# EAGLE design Netzteil_CA1 (EAGLE 8.6.3)

## Sheet 1 of 3
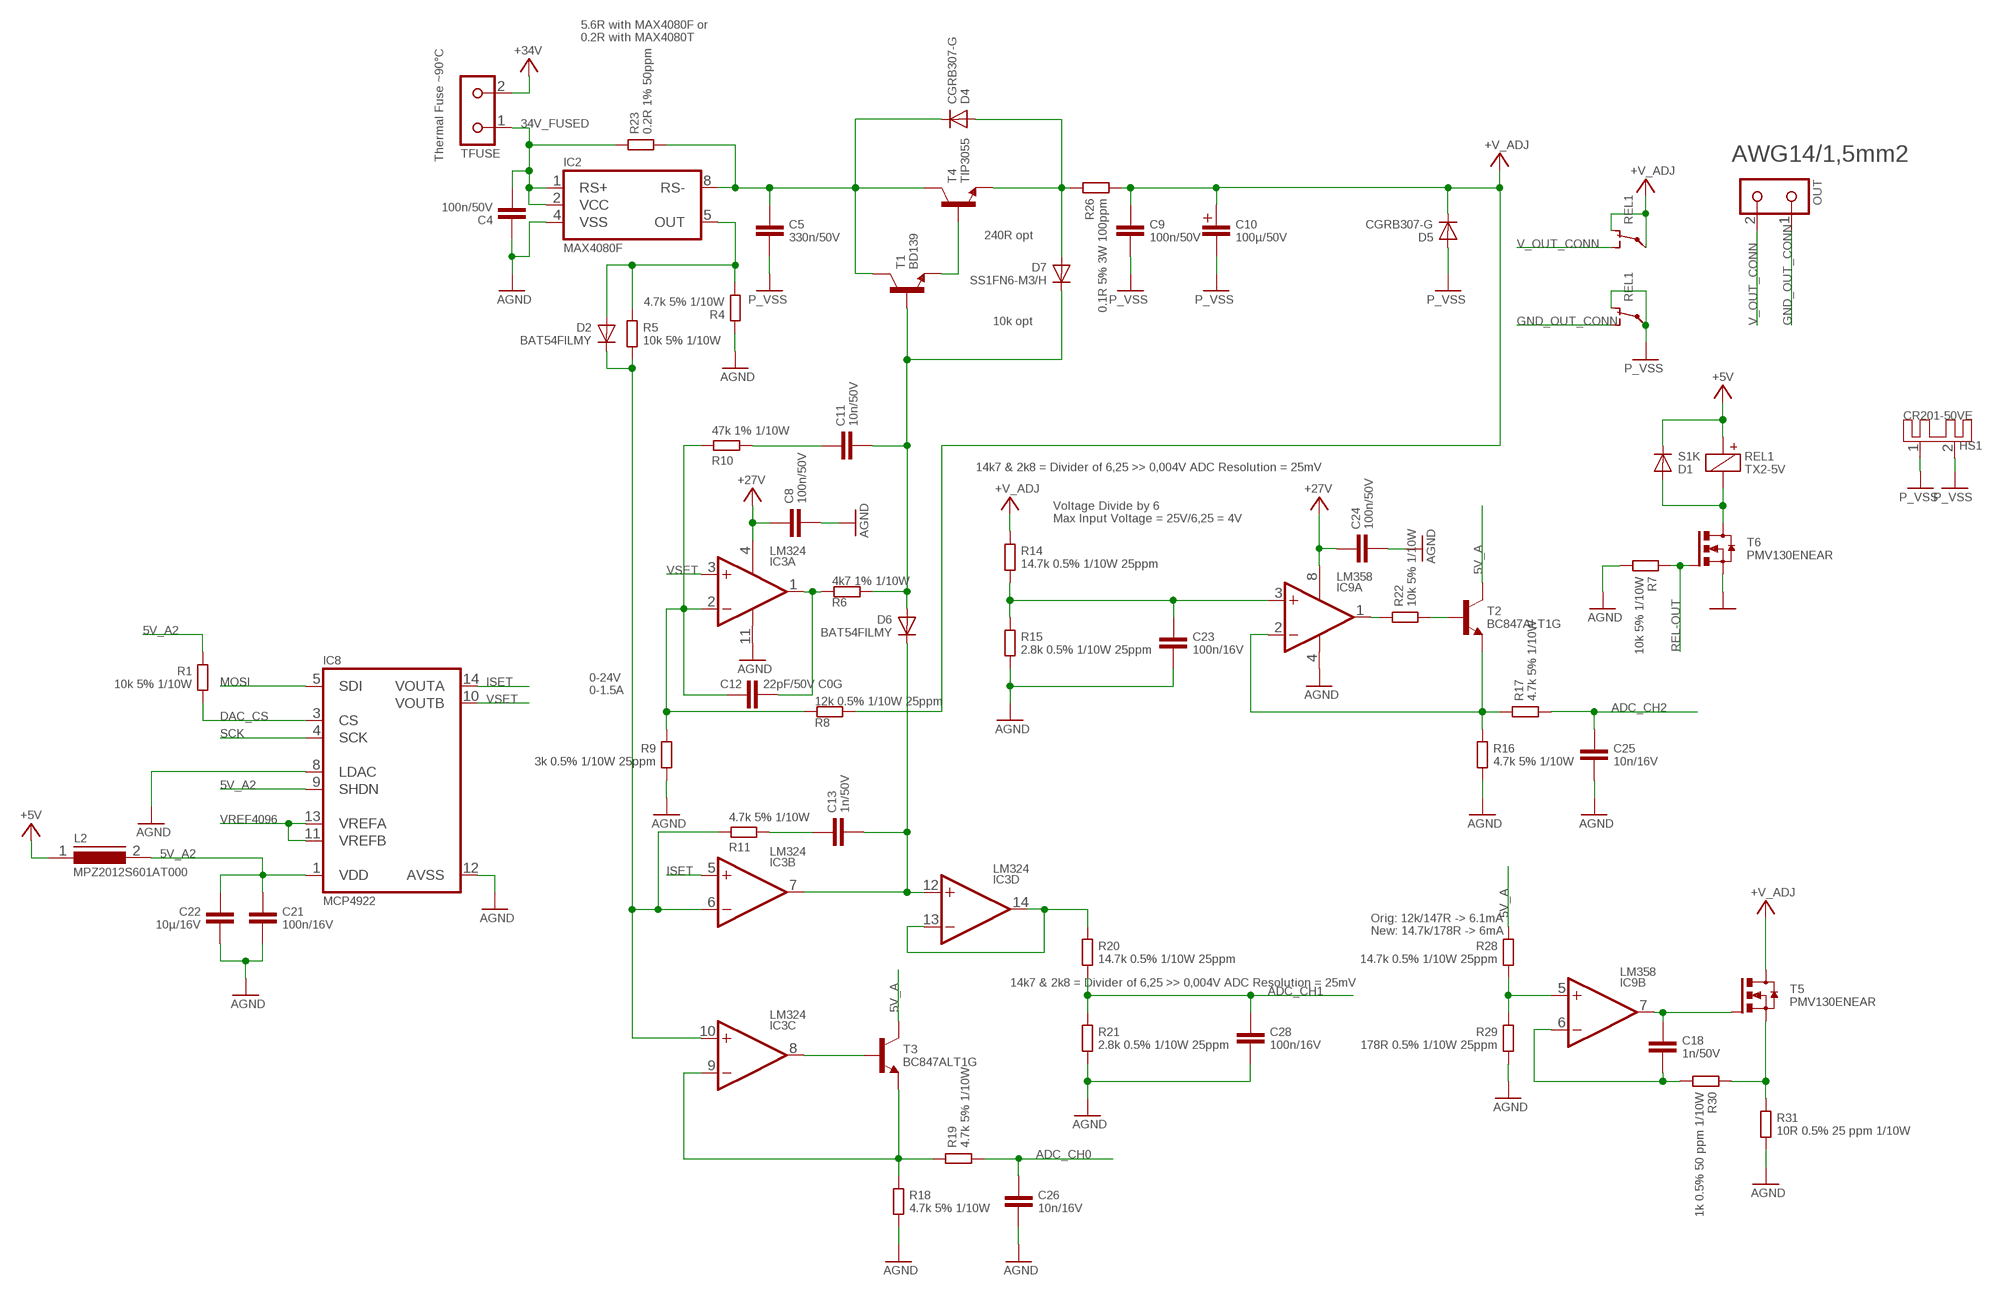
[diagram p0: schematic, sheet 1]

### Parts
C4  100n/50V  CC/0805  [0805]
C5  330n/50V  CC/0805  [0805]
C8  100n/50V  CC/0805  [0805]
C9  100n/50V  CC/0805  [0805]
C10  100µ/50V  C+3.5/8  [C+/3.5/8]
C11  10n/50V  CC/0805  [0805]
C12  22pF/50V C0G  CC/0805  [0805]
C13  1n/50V  CC/0805  [0805]
C18  1n/50V  CC/0805  [0805]
C21  100n/16V  CC/0805  [0805]
C22  10µ/16V  CC/1206  [1206]
C23  100n/16V  CC/0805  [0805]
C24  100n/50V  CC/0805  [0805]
C25  10n/16V  CC/0805  [0805]
C26  10n/16V  CC/0805  [0805]
C28  100n/16V  CC/0805  [0805]
D1  S1K  D  [DO214AC]
D2  BAT54FILMY  DBAT54FILMY  [SOT23]
D4  CGRB307-G  DWIDE  [DO214AA-CGRB307-G]
D5  CGRB307-G  DWIDE  [DO214AA-CGRB307-G]
D6  BAT54FILMY  DBAT54FILMY  [SOT23]
D7  SS1FN6-M3/H  DDO219AB-2  [DO219AB-2]
HS1  CR201-50VE  HSCR201-50  [CR201-50]
IC2  MAX4080F  MAX4080  [SOP8]
IC3  LM324  QUAD-OPVOPA4197  [SO14]
IC8  MCP4922  [TSSOP14]
IC9  LM358  DUAL-OPVSOP8  [SOP8]
L2  MPZ2012S601AT000  L0805  [C0805K]
OUT  KL2691311500002  [KL2-691311500002]
R1  10k 5% 1/10W  R-SMD0805  [C0805K]
R4  4.7k 5% 1/10W  R-SMD0805  [C0805K]
R5  10k 5% 1/10W  R-SMD0805  [C0805K]
R6  4k7 1% 1/10W  R-SMD0805  [C0805K]
R7  10k 5% 1/10W  R-SMD0805  [C0805K]
R8  12k 0.5% 1/10W 25ppm  R-SMD0805  [C0805K]
R9  3k 0.5% 1/10W 25ppm  R-SMD0805  [C0805K]
R10  47k 1% 1/10W  R-SMD0805  [C0805K]
R11  4.7k 5% 1/10W  R-SMD0805  [C0805K]
R14  14.7k 0.5% 1/10W 25ppm  R-SMD0805  [C0805K]
R15  2.8k 0.5% 1/10W 25ppm  R-SMD0805  [C0805K]
R16  4.7k 5% 1/10W  R-SMD0805  [C0805K]
R17  4.7k 5% 1/10W  R-SMD0805  [C0805K]
R18  4.7k 5% 1/10W  R-SMD0805  [C0805K]
R19  4.7k 5% 1/10W  R-SMD0805  [C0805K]
R20  14.7k 0.5% 1/10W 25ppm  R-SMD0805  [C0805K]
R21  2.8k 0.5% 1/10W 25ppm  R-SMD0805  [C0805K]
R22  10k 5% 1/10W  R-SMD0805  [C0805K]
R23  0.2R 1% 50ppm  R-SMDLRMAP2512  [LRMAP2512]
R26  0.1R 5% 3W 100ppm  R-SMD2512  [YAG_PT2512]
R28  14.7k 0.5% 1/10W 25ppm  R-SMD0805  [C0805K]
R29  178R 0.5% 1/10W 25ppm  R-SMD0805  [C0805K]
R30  1k 0.5% 50 ppm 1/10W  R-SMD0805  [C0805K]
R31  10R 0.5% 25 ppm 1/10W  R-SMD0805  [C0805K]
REL1  TX2-5V  REL-2UTX2  [REL-TX2]
T1  BD139  T-NPNTO126-ECB  [TO126]
T2  BC847ALT1G  T-NPNSOT23-BEC  [SOT23-BEC]
T3  BC847ALT1G  T-NPNSOT23-BEC  [SOT23-BEC]
T4  TIP3055  T-NPNTOP3AV-BCE  [TOP3AV]
T5  PMV130ENEAR  T-NMOSIRLML2502PBF  [SOT23]
T6  PMV130ENEAR  T-NMOSIRLML2502PBF  [SOT23]
TFUSE  KL2691311500002  [KL2-691311500002]

### Nets
5V_A: R28.1 T2.C T3.C ; also sheet 2,3
5V_A2: C21.1 C22.1 IC8.1(VDD) IC8.9(SHDN) L2.2 R1.1
34V_FUSED: C4.2 IC2.1(RS+) IC2.2(VCC) R23.1 TFUSE.1
+5V: D1.C L2.1 REL1.+(1:+) ; also sheet 2,3
+27V: C8.1 C24.1 IC3.4(PWR:V+) IC9.8(PWR:V+) ; also sheet 2
+34V: TFUSE.2 ; also sheet 2
+V_ADJ: C9.1 C10.+ D5.C R8.1 R14.1 R26.2 REL1.O1(2:O) REL1.P1(2:P) T5.3(D)
ADC_CH0: C26.1 R19.2 ; also sheet 3
ADC_CH1: C28.1 R20.2 R21.1 ; also sheet 3
ADC_CH2: C25.1 R17.2 ; also sheet 3
AGND: C4.1 C8.2 C21.2 C22.2 C23.2 C24.2 C25.2 C26.2 C28.2 IC2.4(VSS) IC3.11(PWR:V-) IC8.8(LDAC) IC8.12(AVSS) IC9.4(PWR:V-) R4.1 R7.2 R9.2 R15.2 R16.2 R18.2 R21.2 R29.2 R31.2 ; also sheet 2,3
DAC_CS: IC8.3(CS) R1.2 ; also sheet 3
GND_OUT_CONN: OUT.1 REL1.S2(3:S)
ISET: IC3.5(B:+IN) IC8.14(VOUTA)
MOSI: IC8.5(SDI) ; also sheet 3
N$1: C5.1 D4.C IC2.8(RS-) R23.2 T1.2(C) T4.C
N$5: D2.1(A) IC2.5(OUT) R4.2 R5.1
N$6: D2.3(C) IC3.6(B:-IN) IC3.10(C:+IN) R5.2 R11.2
N$7: C12.2 IC3.1(A:OUT) R6.2
N$8: C11.2 D6.1(A) D7.C R6.1 T1.3(B)
N$9: C11.1 R10.1
N$10: C13.2 D6.3(C) IC3.7(B:OUT) IC3.12(D:+IN)
N$11: IC3.13(D:-IN) IC3.14(D:OUT) R20.1
N$12: C13.1 R11.1
N$13: D1.A REL1.-(1:-) T6.3(D)
N$16: IC9.1(A:OUT) R22.1
N$17: C23.1 IC9.3(A:+IN) R14.2 R15.1
N$18: C12.1 IC3.2(A:-IN) R8.2 R9.1 R10.2
N$19: IC9.2(A:-IN) R16.1 R17.1 T2.E
N$20: IC3.9(C:-IN) R18.1 R19.1 T3.E
N$21: R22.2 T2.B
N$22: IC9.5(B:+IN) R28.2 R29.1
N$23: D4.A D7.A R26.1 T4.E
N$24: IC3.8(C:OUT) T3.B
N$25: C18.2 IC9.6(B:-IN) R30.2
N$26: C18.1 IC9.7(B:OUT) T5.1(G)
N$28: T1.1(E) T4.B
N$30: R30.1 R31.1 T5.2(S)
P_VSS: C5.2 C9.2 C10.- D5.A HS1.1 HS1.2 REL1.O2(3:O) REL1.P2(3:P) ; also sheet 2
REL-OUT: R7.1 T6.1(G) ; also sheet 3
SCK: IC8.4(SCK) ; also sheet 3
V_OUT_CONN: OUT.2 REL1.S1(2:S)
VREF4096: IC8.11(VREFB) IC8.13(VREFA) ; also sheet 2,3
VSET: IC3.3(A:+IN) IC8.10(VOUTB)
VSS: T6.2(S) ; also sheet 2,3

### Notes on the sheet
- 5.6R with MAX4080F or 
  0.2R with MAX4080T
- Thermal Fuse ~90°C | AWG14/1,5mm2
- 240R opt
- 10k opt
- 14k7 & 2k8 = Divider of 6,25 >> 0,004V ADC Resolution = 25mV
- Voltage Divide by 6
  Max Input Voltage = 25V/6,25 = 4V
- 0-24V
  0-1.5A
- Orig: 12k/147R -> 6.1mA
  New: 14.7k/178R -> 6mA
- 14k7 & 2k8 = Divider of 6,25 >> 0,004V ADC Resolution = 25mV

## Sheet 2 of 3
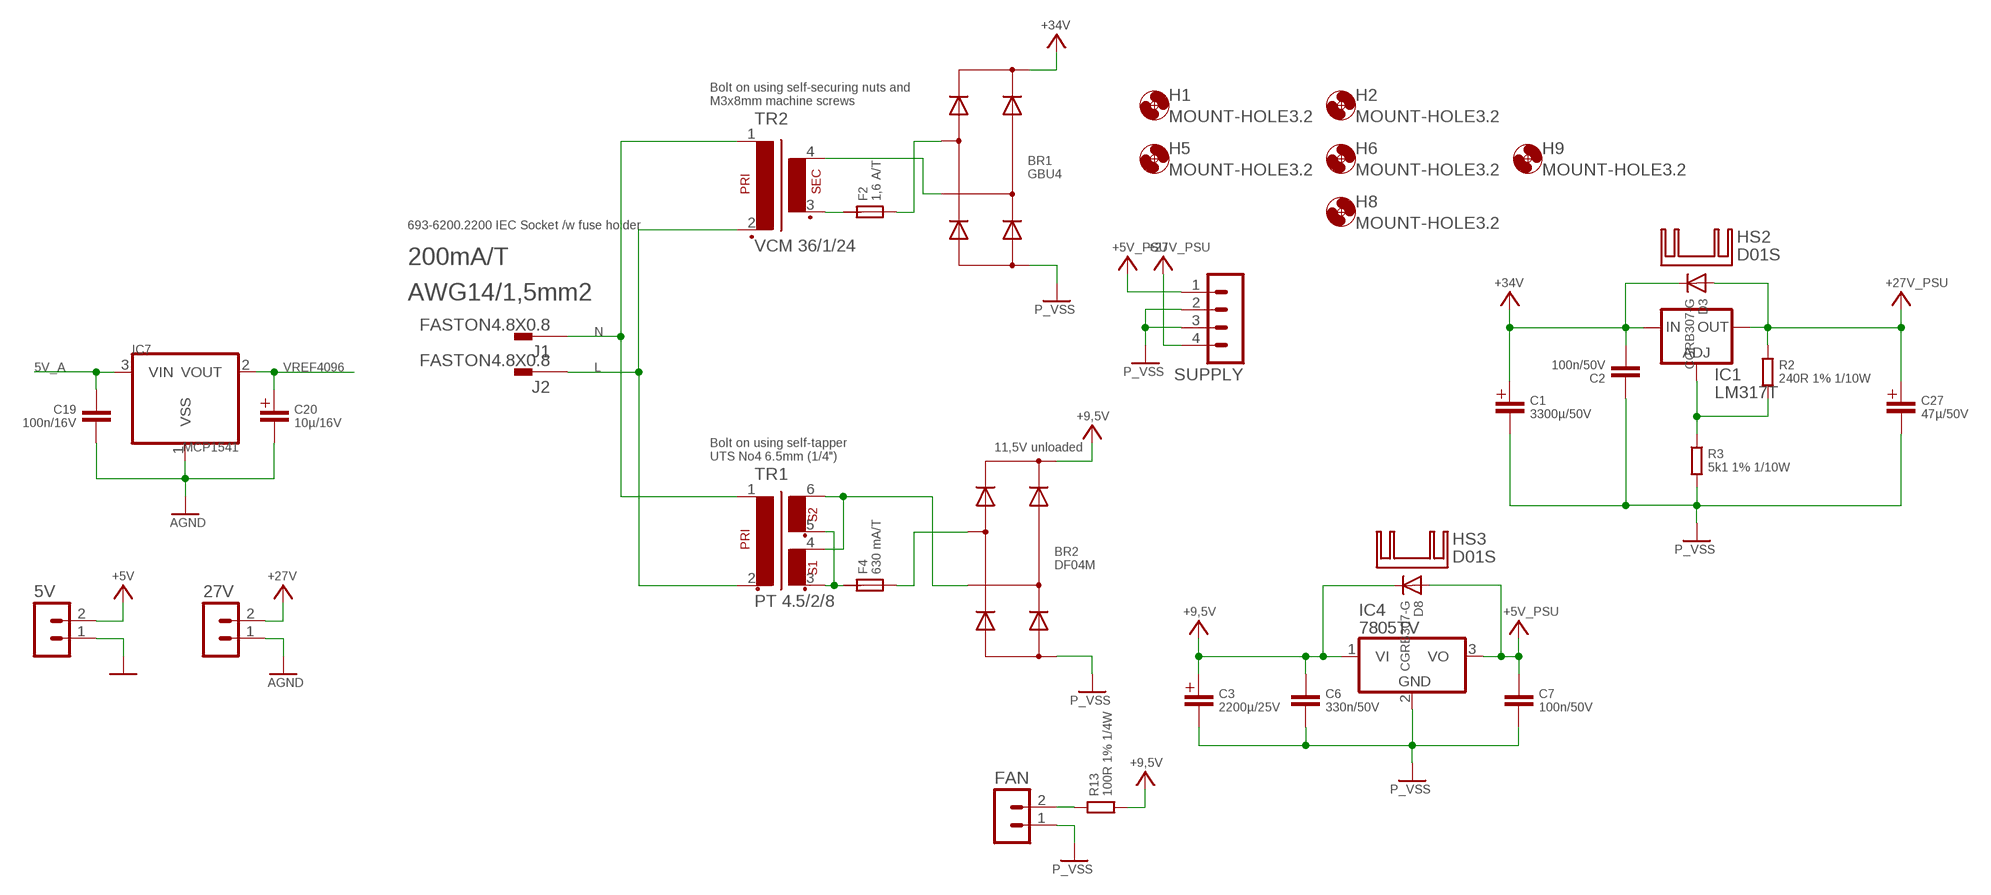
[diagram p1: schematic, sheet 2]

### Parts
5V  JST-PH-2.0-2P  [JST-PH-2.0-2P]
27V  JST-PH-2.0-2P  [JST-PH-2.0-2P]
BR1  GBU4  GBU8M  [GBU4S]
BR2  DF04M  BRDIL2  [BR-DIL2]
C1  3300µ/50V  C+7.5/18  [C+/7.5/18]
C2  100n/50V  CC/0805  [0805]
C3  2200µ/25V  C+5/12.5  [C+/5/12.5]
C6  330n/50V  CC/0805  [0805]
C7  100n/50V  CC/0805  [0805]
C19  100n/16V  CC/0805  [0805]
C20  10µ/16V  C+1.5/4  [C+/1.5/4]
C27  47µ/50V  C+2.5/6.3  [C+/2.5/6.3]
D3  CGRB307-G  DWIDE  [DO214AA-CGRB307-G]
D8  CGRB307-G  DWIDE  [DO214AA-CGRB307-G]
F2  1,6 A/T  F5X20  [F5X20]
F4  630 mA/T  F5X20  [F5X20]
FAN  JST-PH-2.0-2P  [JST-PH-2.0-2P]
H1  MOUNT-HOLE3.2  [3,2]
H2  MOUNT-HOLE3.2  [3,2]
H5  MOUNT-HOLE3.2  [3,2]
H6  MOUNT-HOLE3.2  [3,2]
H8  MOUNT-HOLE3.2  [3,2]
H9  MOUNT-HOLE3.2  [3,2]
HS2  D01S  [D01S]
HS3  D01S  [D01S]
IC1  LM317T  LM317TS  [317TS]
IC4  7805TV  [TO220V]
IC7  MCP1541  [TO92-G]
J1  FASTON4.8X0.8  [FASTON-4.8X0.8]
J2  FASTON4.8X0.8  [FASTON-4.8X0.8]
R2  240R 1% 1/10W  R-SMD0805  [C0805K]
R3  5k1 1% 1/10W  R-SMD0805  [C0805K]
R13  100R 1% 1/4W  R-SMD0805  [C0805K]
SUPPLY  JST-PH-2.0-4P  [JST-PH-2.0-4P]
TR1  PT 4.5/2/8  PT4,5/2/..  [PT/4,5/2/..]
TR2  VCM 36/1/24  VCM36/1/24  [VCM36/1/24]

### Nets
5V_A: C19.1 IC7.3(VIN) ; also sheet 1,3
+5V: 5V.2 ; also sheet 1,3
+5V_PSU: C7.1 D8.A IC4.3(VO) SUPPLY.1
+9,5V: BR2.DC+ C3.+ C6.1 D8.C IC4.1(VI) R13.2
+27V: 27V.2 ; also sheet 1
+27V_PSU: C27.+ D3.A IC1.2(OUT) R2.1 SUPPLY.4
+34V: BR1.+(DC+) C1.+ C2.2 D3.C IC1.3(IN) ; also sheet 1
AGND: 27V.1 C19.2 C20.- IC7.1(VSS) ; also sheet 1,3
L: J2.A1 J2.A2 TR1.2 TR2.2
N: J1.A1 J1.A2 TR1.1 TR2.1
N$4: IC1.1(ADJ) R2.2 R3.1
N$27: BR2.AC1 F4.3 F4.4
N$29: F2.1 F2.2 TR2.3(S3)
N$31: BR1.AC1 F2.3 F2.4
N$32: BR1.AC2 TR2.4(S4)
N$33: F4.1 F4.2 TR1.3 TR1.5
N$34: BR2.AC2 TR1.4 TR1.6
N$35: FAN.2 R13.1
P_VSS: BR1.-(DC-) BR2.DC- C1.- C2.1 C3.- C6.2 C7.2 C27.- FAN.1 IC4.2(GND) R3.2 SUPPLY.2 SUPPLY.3 ; also sheet 1
VREF4096: C20.+ IC7.2(VOUT) ; also sheet 1,3
VSS: 5V.1 ; also sheet 1,3

### Notes on the sheet
- Bolt on using self-securing nuts and
  M3x8mm machine screws
- 693-6200.2200 IEC Socket /w fuse holder
- 200mA/T
- AWG14/1,5mm2
- 11,5V unloaded
- Bolt on using self-tapper
  UTS No4 6.5mm (1/4")

## Sheet 3 of 3
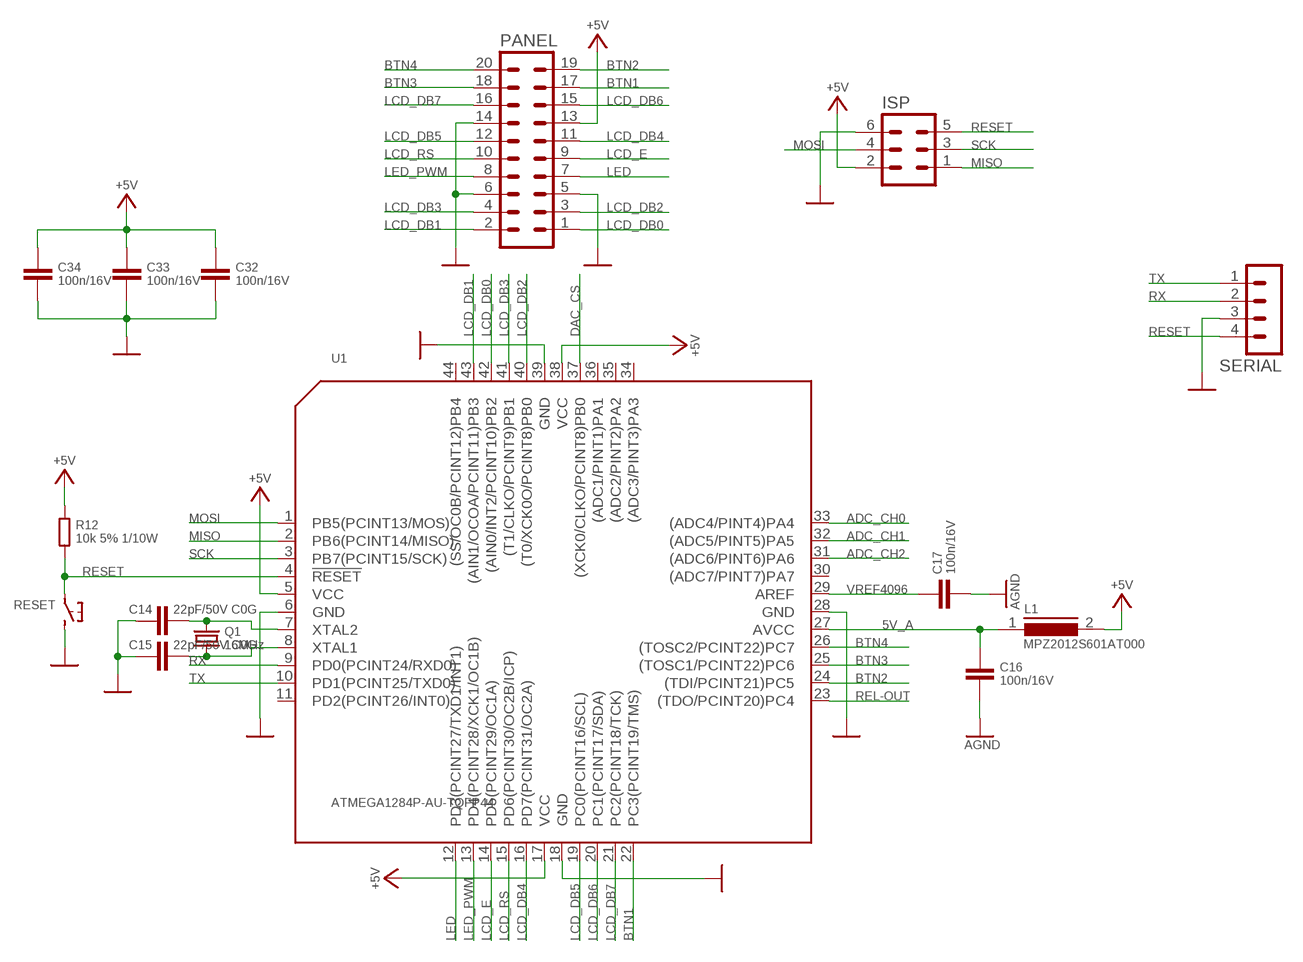
[diagram p2: schematic, sheet 3]

### Parts
C14  22pF/50V C0G  CC/0805  [0805]
C15  22pF/50V C0G  CC/0805  [0805]
C16  100n/16V  CC/0805  [0805]
C17  100n/16V  CC/0805  [0805]
C32  100n/16V  CC/0805  [0805]
C33  100n/16V  CC/0805  [0805]
C34  100n/16V  CC/0805  [0805]
ISP  ML6  [ML6]
L1  MPZ2012S601AT000  L0805  [C0805K]
PANEL  MA10-2  [MA10-2]
Q1  16MHz  Q5X3.2MM-TXC-7A-SERIES  [Q-5X3.2MM-TXC-7A.SERIES]
R12  10k 5% 1/10W  R-SMD0805  [C0805K]
RESET  TS1B3F-10XX  [B3F-10XX]
SERIAL  MA04-1  [MA04-1]
U1  ATMEGA1284P-AU-TQFP44  MCU-ATMEGA1284P-AU(TQFP44)  [TQFP44-0.8-9.6X9.6MM]

### Nets
5V_A: C16.1 L1.1 U1.27(AVCC) ; also sheet 1,2
+5V: C32.1 C33.1 C34.1 ISP.2 L1.2 PANEL.13 R12.1 U1.5(VCC) U1.17(VCC) U1.38(VCC) ; also sheet 1,2
ADC_CH0: U1.33((ADC4/PINT4)PA4) ; also sheet 1
ADC_CH1: U1.32((ADC5/PINT5)PA5) ; also sheet 1
ADC_CH2: U1.31((ADC6/PINT6)PA6) ; also sheet 1
AGND: C16.2 C17.2 ; also sheet 1,2
BTN1: PANEL.17 U1.22(PC3(PCINT19/TMS))
BTN2: PANEL.19 U1.24((TDI/PCINT21)PC5)
BTN3: PANEL.18 U1.25((TOSC1/PCINT22)PC6)
BTN4: PANEL.20 U1.26((TOSC2/PCINT22)PC7)
DAC_CS: U1.37((XCK0/CLKO/PCINT8)PB0) ; also sheet 1
LCD_DB0: PANEL.1 U1.42((AIN0/INT2/PCINT10)PB2)
LCD_DB1: PANEL.2 U1.43((AIN1/OCOA/PCINT11)PB3)
LCD_DB2: PANEL.3 U1.40((T0/XCK0O/PCINT8)PB0)
LCD_DB3: PANEL.4 U1.41((T1/CLKO/PCINT9)PB1)
LCD_DB4: PANEL.11 U1.16(PD7(PCINT31/OC2A))
LCD_DB5: PANEL.12 U1.19(PC0(PCINT16/SCL))
LCD_DB6: PANEL.15 U1.20(PC1(PCINT17/SDA))
LCD_DB7: PANEL.16 U1.21(PC2(PCINT18/TCK))
LCD_E: PANEL.9 U1.14(PD5(PCINT29/OC1A))
LCD_RS: PANEL.10 U1.15(PD6(PCINT30/OC2B/ICP))
LED: PANEL.7 U1.12(PD3(PCINT27/TXD1/INT1))
LED_PWM: PANEL.8 U1.13(PD4(PCINT28/XCK1/OC1B))
MISO: ISP.1 U1.2(PB6(PCINT14/MISO))
MOSI: ISP.4 U1.1(PB5(PCINT13/MOS)) ; also sheet 1
N$14: C14.2 Q1.2 U1.7(XTAL2)
N$15: C15.2 Q1.1 U1.8(XTAL1)
REL-OUT: U1.23((TDO/PCINT20)PC4) ; also sheet 1
RESET: ISP.5 R12.2 RESET.1 SERIAL.4 U1.4(!RESET)
RX: SERIAL.2 U1.9(PD0(PCINT24/RXD0))
SCK: ISP.3 U1.3(PB7(PCINT15/SCK)) ; also sheet 1
TX: SERIAL.1 U1.10(PD1(PCINT25/TXD0))
VREF4096: C17.1 U1.29(AREF) ; also sheet 1,2
VSS: C14.1 C15.1 C32.2 C33.2 C34.2 ISP.6 PANEL.5 PANEL.6 PANEL.14 RESET.3 SERIAL.3 U1.6(GND) U1.18(GND) U1.28(GND) U1.39(GND) ; also sheet 1,2
Unconnected: U1.11(PD2(PCINT26/INT0)) U1.30((ADC7/PINT7)PA7) U1.34((ADC3/PINT3)PA3) U1.35((ADC2/PINT2)PA2) U1.36((ADC1/PINT1)PA1) U1.44((SS/OC0B/PCINT12)PB4)

## Library data of the parts
5V 27V = neumluc:JST-PH-2.0-2P: PIN HEADER; OC_DIGIKEY: 455-1704-ND
BR1 = neumluc:GBU8M: GENERAL INSTRUMENT RECTIFIER; OC_MOUSER: 833-GBU4JL-BP
BR2 = goujine:BR; OC_MOUSER: 621-DF04M; OC_MOUSER_ALT: 512-DF04M
C1 = neumluc:C+; OC_MOUSER: 667-EEU-HD1H332; OC_MOUSER_ALT: 647-UVZ1H332MHD
C2 C4 C7-C9 C16 C17 C19 C21 C23 C24 C28 C32-C34 = goujine:C: Kondensator; OC_MOUSER: 810-C2012X7R2A104K
C3 = neumluc:C+; OC_MOUSER: 667-EEU-FS1E222
C5 C6 = goujine:C: Kondensator; OC_MOUSER: 80-C0805C334K5RECTU
C10 = neumluc:C+; OC_MOUSER: 667-EEU-FR1H101
C11 C25 C26 = goujine:C: Kondensator; OC_MOUSER: 80-C0805C103K1R
C12 C14 C15 = goujine:C: Kondensator; OC_MOUSER: 603-CC805JRNPO9BN220
C13 C18 = goujine:C: Kondensator; OC_MOUSER: 603-CC805KRX7R0BB102
C20 = neumluc:C+; OC_MOUSER: 647-USV1C100MFD1TP
C22 = goujine:C: Kondensator; OC_MOUSER: 963-TMK316AB7106KL-T
C27 = neumluc:C+; OC_MOUSER: 667-EEU-FR1H470
D1 = neumluc:D; OC_MOUSER: 512-S1K
D2 D6 = neumluc:D; OC_MOUSER: 511-BAT54FILMY
D3-D5 D8 = neumluc:D; OC_MOUSER: 750-CGRB307-G
D7 = neumluc:D; OC_MOUSER: 78-SS1FN6-M3/H
F2 F4 = goujine:F: Sicherung; OC_MOUSER: 693-0751.0110
FAN = neumluc:JST-PH-2.0-2P: PIN HEADER; OC_DIGIKEY: 455-1704-ND; OC_MOUSER_ADD: 369-MF60251V21UA99
H1 H5 H6 H8 H9 = holes:MOUNT-HOLE: MOUNTING HOLE with drill center marker; OC_RS: 546-5604
H2 = holes:MOUNT-HOLE: MOUNTING HOLE with drill center marker; OC_RS: 184-2740; OC_RS_ADD: 291-379; OC_RS_ADD2: 161-3689
HS1 = neumluc:HS; OC_MOUSER: 588-CR201-50VE; OC_MOUSER_ADD: 567-CD-02-05-247-N
HS2 HS3 = heatsink:D01S: HEATSINK distributor Schukat; OC_MOUSER: 532-576802B00
IC1 = v-reg:LM317TS: VOLTAGE REGULATOR; OC_MOUSER: 511-LM317T
IC2 = neumluc:MAX4080; OC_MOUSER: 700-MAX4080FASA
IC3 = neumluc:QUAD-OPV; OC_MOUSER: 595-LM324ADR
IC4 = linear:78*: Positive VOLTAGE REGULATOR Source: http://cache.national.com/ds/LM/LM78L05.pdf http://www.fairchildsemi.com/ds/LM/LM7805.pdf; OC_MOUSER: 511-L7805CV
IC7 = neumluc:MCP1541: LM134/LM234/LM334 3-Terminal Adjustable Current Sources; OC_MOUSER: 579-MCP1541ITO
IC8 = neumluc:MCP4922; OC_MOUSER: 579-MCP4922T-E/ST
IC9 = goujine:DUAL-OPV; OC_MOUSER: 595-LM358ADR
ISP = neumluc:ML6: HARTING; OC_FARNELL: unknown; OC_MOUSER: 200-TSW10307TD; OC_NEWARK: unknown
J1 J2 = neumluc:FASTON: Flachstecker Typ Tyco/Electronics/AMP TAB, FASTON Printed Circuit Board Tabs Source: http://www.buerklin.com, http://catalog.tycoelectronics.com; OC_CONRAD: 736079; OC_CONRAD_ADD: 1022092; OC_FARNELL: unknown; OC_NEWARK: unknown
L1 L2 = neumluc:L: High Power Density, High Efficiency, Shielded Inductors; OC_MOUSER: 810-MPZ2012S601AT000
OUT = neumluc:KL2: Printklemme 2-polig; OC_MOUSER: 710-691311500002; OC_MOUSER_ADD: 565-6883
PANEL = con-lstb:MA10-2: PIN HEADER; OC_FARNELL: unknown; OC_MOUSER: 200-TSW10707FD; OC_NEWARK: unknown; OC_RS: 289-9896; OC_RS_ADD: 832-3516
Q1 = neumluc:Q; OC_MOUSER: 717-7A-16.000MAAJ-T
R1 R5 R7 R12 R22 = neumluc:R-SMD: R SMD; OC_MOUSER: 652-CR0805-JW-103ELF
R2 = neumluc:R-SMD: R SMD; OC_MOUSER: 652-CR0805FX-2400ELF
R3 = neumluc:R-SMD: R SMD; OC_MOUSER: 652-CR0805FX-5101ELF
R4 R11 R16-R19 = neumluc:R-SMD: R SMD; OC_MOUSER: 652-CR0805-JW-472ELF
R6 = neumluc:R-SMD: R SMD; OC_MOUSER: 652-CR0805FX-1001ELF
R8 = neumluc:R-SMD: R SMD; OC_MOUSER: 754-RR1220P-123D
R9 = neumluc:R-SMD: R SMD; OC_MOUSER: 754-RR1220P-302D
R10 = neumluc:R-SMD: R SMD; OC_MOUSER: 652-CR0805FX-4702ELF
R13 = neumluc:R-SMD: R SMD; OC_MOUSER: 660-RK73H2ATTD75R0F
R14 R20 R28 = neumluc:R-SMD: R SMD; OC_MOUSER: 754-RR1220P-1472D-M; OC_MOUSER_OLD: 754-RR1220P-123D; OC_RS: 708-6470
R15 R21 = neumluc:R-SMD: R SMD; OC_MOUSER: 754-RR1220P-2801D-M; OC_MOUSER_OLD: 754-RR1220P-242D; OC_RS: 708-6250
R23 = neumluc:R-SMD: R SMD; OC_MOUSER: 756-LRMAP2512R20FT4
R26 = neumluc:R-SMD: R SMD; OC_MOUSER: 652-CRA2512FZR100ELF
R29 = neumluc:R-SMD: R SMD; OC_MOUSER: 754-RR1220P-1780D-M; OC_MOUSER_ALT2_OLD: 667-ERA-6AEB1470V; OC_MOUSER_ALT_OLD: 754-RR1220P-151D; OC_MOUSER_OLD: 754-RR1220P-1470D-M; OC_RS: 708-9340
R30 = neumluc:R-SMD: R SMD; OC_MOUSER: 754-RR1220P-102D
R31 = neumluc:R-SMD: R SMD; OC_MOUSER: 660-RN732ATTD10R0D25; OC_MOUSER_ALT: 279-2-1625868-7
REL1 = neumluc:REL-2U; OC_MOUSER: 769-TX2-5V
RESET = neumluc:TS1; OC_MOUSER: 653-B3F-1022
SERIAL = con-lstb:MA04-1: PIN HEADER; OC_FARNELL: unknown; OC_MOUSER: 200-TSW10407TS; OC_NEWARK: unknown
SUPPLY = neumluc:JST-PH-2.0-4P: PIN HEADER; OC_DIGIKEY: 455-1706-ND
T1 = neumluc:T-NPN: NPN Transistor; OC_MOUSER: 511-BD139-10
T2 T3 = neumluc:T-NPN: NPN Transistor; OC_MOUSER: 863-BC847ALT1G
T4 = neumluc:T-NPN: NPN Transistor; OC_MOUSER: 863-TIP3055G
T5 T6 = neumluc:T-NMOS: Transistor N-Channel MOSFET; OC_MOUSER: 771-PMV130ENEAR
TFUSE = neumluc:KL2: Printklemme 2-polig; OC_MOUSER: 710-691311500002; OC_RS_ADD: 712-7284
TR1 = neumluc:PT4,5/2/..: TRANSFORMER 1 primary winding, 1 secondary winding, mounting holes BLOCK; OC_RS: 201-8463; OC_RS_ADD: 546-5604
TR2 = neumluc:VCM36/1/24: TRANSFORMER 1 primary winding, 1 secondary winding, mounting holes BLOCK; OC_RS: 732-0506
U1 = Seeed-OPL-ic:MCU-ATMEGA1284P-AU(TQFP44): 310010020; MPN: ATMEGA1284P-AU; OC_MOUSER: 556-ATMEGA1284P-AU

## Board
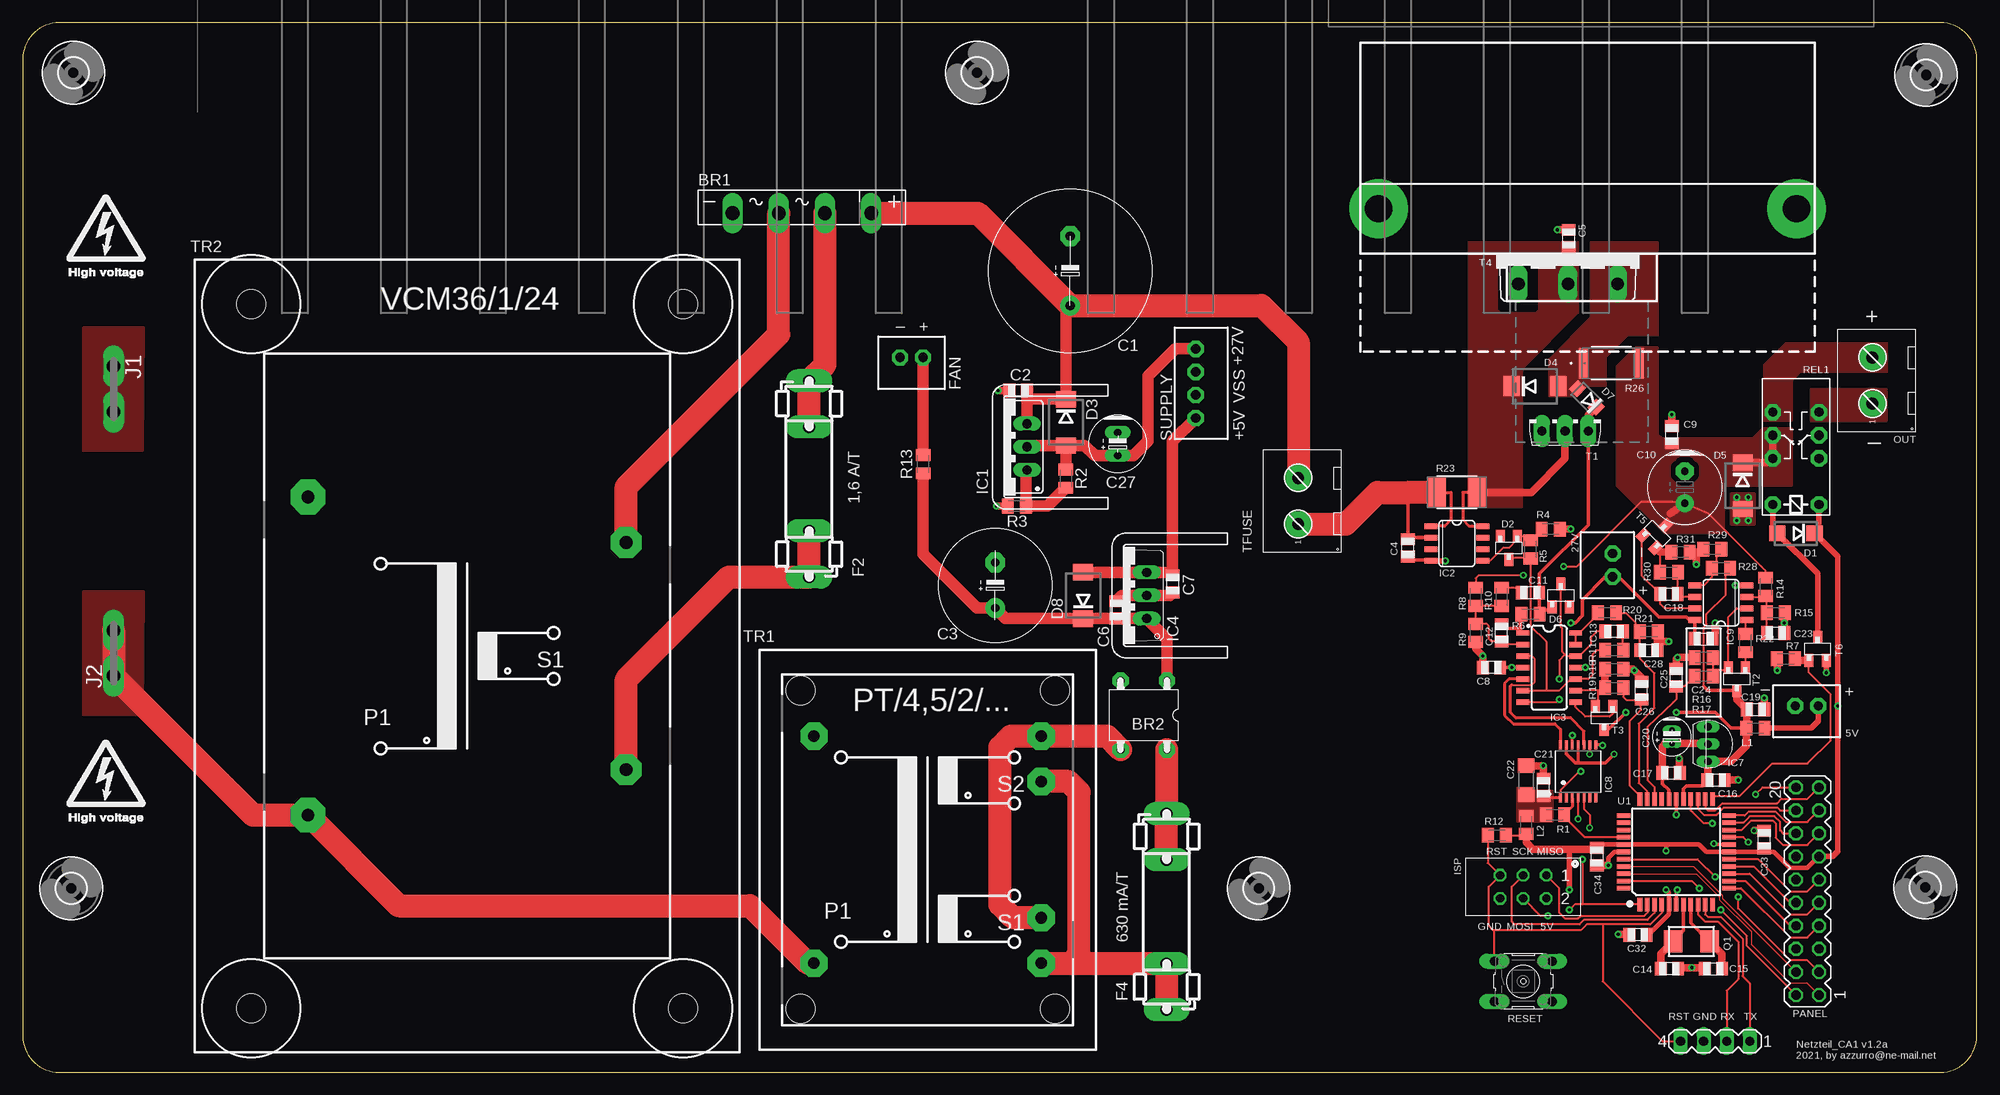
[diagram p3: board, top side]
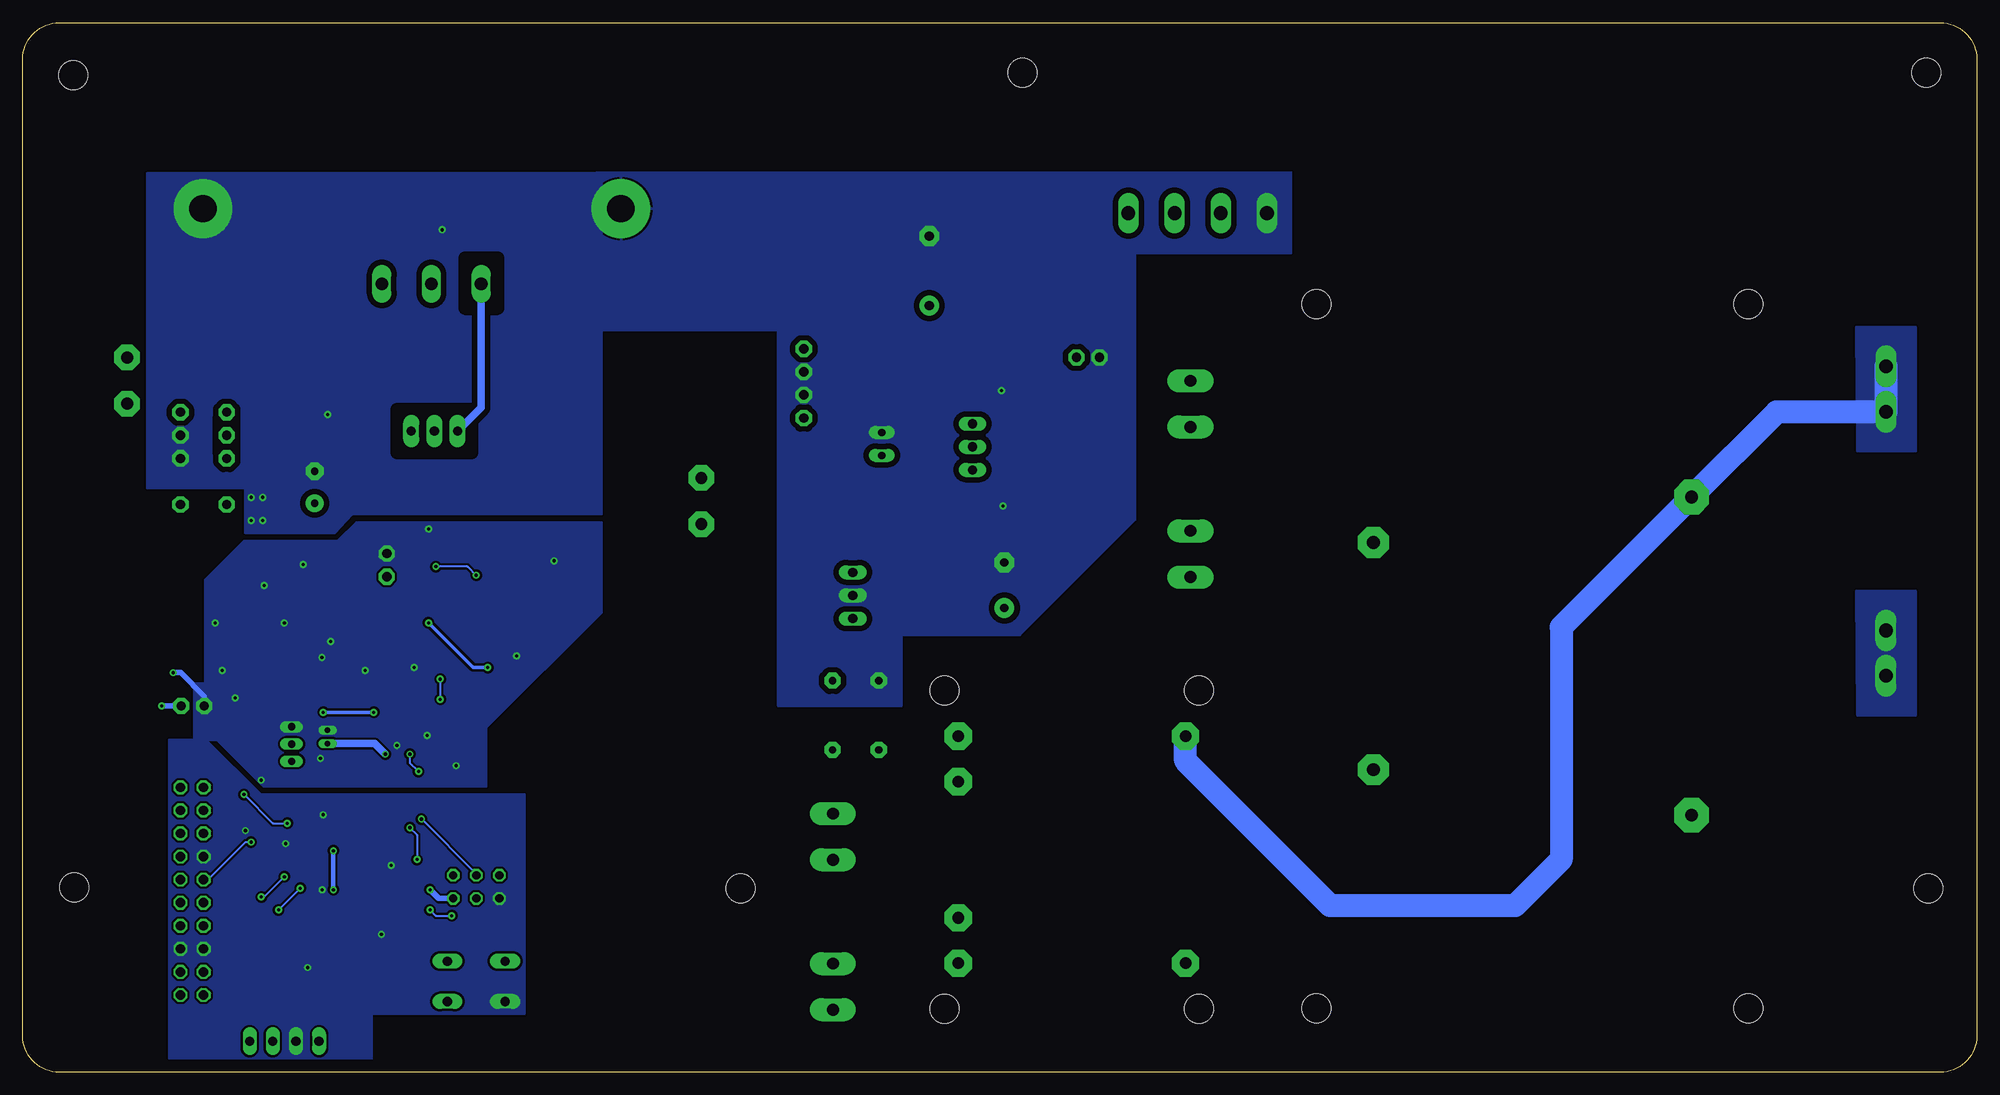
[diagram p4: board, bottom side, seen from below]

Size 215 x 115.5 mm. Coordinates in mm from the lower left corner, seen from the top.
Outline: 215,4 215,111.5 arc90 211,115.5 4,115.5 arc90 0,111.5 0,4 arc90 4,0 211,0 arc90 215,4
Copper layers (1*16): Top 0.035mm / dielectric 1.6mm / Bottom 0.035mm
Design rules "JLCPCB_2-layer_PCB_eagle_rule *": minimum track width 5mil, minimum drill 0.2mm, track to track 5mil, track to pad 5mil, pad to pad 5mil, via to via 8mil, smd to smd 0mil, copper to edge 8mil, drill to drill 10mil, minimum pad ring 3mil, minimum via ring 8mil, stop-mask expansion 0mil, vias tented up to drill 100mil, thermal gap 10mil
tRestrict: area 162.7,84.1 to 166.4,89.6
bRestrict: area 162.7,84.1 to 166.4,89.6; area 165.6,68.2 to 173.8,73; area 191.8,68 to 193.4,72.2

### Footprints (pad centres in the part's own frame; a part is rotated, then mirrored left to right if it is on the bottom)
JST-PH-2.0-2P = drill 1.016 pad 1.778 octagon: 1 -1.27,0; 2 1.27,0
GBU4S = drill 1.499 long: + 7.62,0; - -7.62,0; AC1 2.54,0; AC2 -2.54,0
BR-DIL2 = drill 0.8 pad 1.778 octagon: AC1 -2.54,3.81; AC2 2.54,3.81; DC+ -2.54,-3.81; DC- 2.54,-3.81
C+/7.5/18 = drill 1 pad 2.184: + -3.81,0 | drill 1 pad 2.184 octagon: - 3.81,0
0805 = smd 1.3 x 1.5: 1 -0.953,0; 2 0.953,0
C+/5/12.5 = drill 0.9 pad 2.184: + -2.5,0 | drill 0.9 pad 2.184 octagon: - 2.5,0
C+/3.5/8 = drill 0.813 pad 1.93: + -1.778,0 | drill 0.813 pad 1.93 octagon: - 1.778,0
C+/1.5/4 = drill 0.6 pad 1 long: + -0.75,0; - 0.75,0
1206 = smd 1.803 x 1.6: 1 0,1.587; 2 0,-1.587
C+/2.5/6.3 = drill 0.8 pad 1.422 long: + -1.27,0; - 1.27,0
DO214AC = smd 1.8 x 1.7: A 2.05,0; C -2.05,0
SOT23 = smd 1 x 1.4: 1 -0.953,-1.27; 2 0.953,-1.27; 3 0,1.27
DO214AA-CGRB307-G = smd 1.8 x 2.2: A 2.55,0; C -2.55,0
DO219AB-2 = smd 1.3 x 1.4: A 1.45,0; C -1.45,0
F5X20 = drill 1.3 pad 2.54 long: 1 -11.43,0; 2 -6.35,0; 3 5.08,0; 4 10.16,0
3,2 = hole 3.2: 0,0
CR201-50 = drill 3 pad 6.452: 1 -23,-4.95; 2 23,-4.95
317TS = drill 1.016 long: 1 -2.54,-2.54; 2 0,-2.54; 3 2.54,-2.54
SOP8 = smd 0.635 x 1.422: 1 -1.905,-2.857; 2 -0.635,-2.857; 3 0.635,-2.857; 4 1.905,-2.857; 5 1.905,2.857; 6 0.635,2.857; 7 -0.635,2.857; 8 -1.905,2.857
SO14 = smd 0.6 x 1.4: 1 -3.81,-2.9; 2 -2.54,-2.9; 3 -1.27,-2.9; 4 0,-2.9; 5 1.27,-2.9; 6 2.54,-2.9; 7 3.81,-2.9; 8 3.81,2.9; 9 2.54,2.9; 10 1.27,2.9; 11 0,2.9; 12 -1.27,2.9; 13 -2.54,2.9; 14 -3.81,2.9
TO220V = drill 1.016 long: 1 -2.54,-2.54; 2 0,-2.54; 3 2.54,-2.54
TO92-G = drill 0.8 pad 1.27 long: 1 -1.905,0; 2 0,0; 3 1.905,0
TSSOP14 = smd 0.305 x 0.991: 1 -1.95,-2.918; 2 -1.3,-2.918; 3 -0.65,-2.918; 4 0,-2.918; 5 0.65,-2.918; 6 1.3,-2.918; 7 1.95,-2.918; 8 1.95,2.918; 9 1.3,2.918; 10 0.65,2.918; 11 0,2.918; 12 -0.65,2.918; 13 -1.3,2.918; 14 -1.95,2.918
ML6 = drill 0.914 octagon: 1 -2.54,-1.27; 2 -2.54,1.27; 3 0,-1.27; 4 0,1.27; 5 2.54,-1.27; 6 2.54,1.27
FASTON-4.8X0.8 = drill 1.5 pad 2.3 long: A1 -2.5,0; A2 2.5,0
C0805K = smd 1.3 x 1.6: 1 -1,0; 2 1,0
KL2-691311500002 = drill 1.3 pad 2.8 octagon: 1 -2.54,0; 2 2.54,0
MA10-2 = drill 1.016 octagon: 1 -11.43,-1.27; 2 -11.43,1.27; 3 -8.89,-1.27; 4 -8.89,1.27; 5 -6.35,-1.27; 6 -6.35,1.27; 7 -3.81,-1.27; 8 -3.81,1.27; 9 -1.27,-1.27; 10 -1.27,1.27; 11 1.27,-1.27; 12 1.27,1.27; 13 3.81,-1.27; 14 3.81,1.27; 15 6.35,-1.27; 16 6.35,1.27; 17 8.89,-1.27; 18 8.89,1.27; 19 11.43,-1.27; 20 11.43,1.27
Q-5X3.2MM-TXC-7A.SERIES = smd 2 x 2.4: 1 -2,0; 2 2,0
LRMAP2512 = smd 2 x 3.2: 1 -2.2,0; 2 2.2,0
YAG_PT2512 = smd 1.067 x 3.353: 1 -3.048,0; 2 3.048,0
REL-TX2 = drill 1 pad 1.8 octagon: + -6.35,-2.54; - -6.35,2.54; O1 -1.27,2.54; O2 -1.27,-2.54; P1 1.27,2.54; P2 1.27,-2.54; S1 3.81,2.54; S2 3.81,-2.54
B3F-10XX = drill 1 pad 1.676 long: 1 -3.175,1.905; 2 3.175,1.905; 3 -3.175,-2.54; 4 3.175,-2.54
MA04-1 = drill 1.016 long: 1 -3.81,0; 2 -1.27,0; 3 1.27,0; 4 3.81,0
JST-PH-2.0-4P = drill 1.016 pad 1.778 octagon: 1 -3.81,0; 2 -1.27,0; 3 1.27,0; 4 3.81,0
TO126 = drill 1 pad 1.778 long: 1 -2.54,0; 2 0,0; 3 2.54,0
SOT23-BEC = smd 1 x 1.4: B -0.953,-1.27; C 0,1.27; E 0.953,-1.27
TOP3AV = drill 1.397 long: B -5.461,-3.175; C 0,-3.175; E 5.461,-3.175
PT/4,5/2/.. = drill 1.27 pad 3 octagon: 1 -12.5,12.5; 2 -12.5,-12.5; 3 12.5,-12.5; 4 12.5,-7.5; 5 12.5,7.5; 6 12.5,12.5 | hole 3.2: -14,17.5; -14,-17.5; 14,-17.5; 14,17.5
VCM36/1/24 = drill 1.397 pad 3.81 octagon: 1 -17.5,17.5; 2 -17.5,-17.5 | drill 1.397 pad 3.4 octagon: 3 17.5,-12.5; 4 17.5,12.5 | hole 3.2: -23.75,38.75; 23.75,38.75; -23.75,-38.75; 23.75,-38.75
TQFP44-0.8-9.6X9.6MM = smd 1.5 x 0.5: 1 -5.8,4; 2 -5.8,3.2; 3 -5.8,2.4; 4 -5.8,1.6; 5 -5.8,0.8; 6 -5.8,0; 7 -5.8,-0.8; 8 -5.8,-1.6; 9 -5.8,-2.4; 10 -5.8,-3.2; 11 -5.8,-4; 23 5.8,-4; 24 5.8,-3.2; 25 5.8,-2.4; 26 5.8,-1.6; 27 5.8,-0.8; 28 5.8,0; 29 5.8,0.8; 30 5.8,1.6; 31 5.8,2.4; 32 5.8,3.2; 33 5.8,4 | smd 0.5 x 1.5: 12 -4,-5.8; 13 -3.2,-5.8; 14 -2.4,-5.8; 15 -1.6,-5.8; 16 -0.8,-5.8; 17 0,-5.8; 18 0.8,-5.8; 19 1.6,-5.8; 20 2.4,-5.8; 21 3.2,-5.8; 22 4,-5.8; 34 4,5.8; 35 3.2,5.8; 36 2.4,5.8; 37 1.6,5.8; 38 0.8,5.8; 39 0,5.8; 40 -0.8,5.8; 41 -1.6,5.8; 42 -2.4,5.8; 43 -3.2,5.8; 44 -4,5.8

### Placement (x,y rotation side)
5V  196.29,40.32 0 top
27V  174.94,55.8 270 top
BR1  85.72,94.54 0 top
BR2  123.35,39.3 180 top
C1  115.25,88.19 90 top
C2  109.54,75.01 0 top
C3  107,53.58 90 top
C4  152.4,57.71 90 top
C5  170.1,91.76 90 top
C6  120.33,50.88 90 top
C7  126.52,53.74 270 top
C8  161.61,44.53 180 top
C9  181.45,70.17 90 top
C10  182.88,64.38 90 top
C11  165.89,52.79 0 top
C12  162.72,48.34 90 top
C13  175.1,48.5 180 top
C14  181.17,11.39 180 top
C15  186.02,11.39 0 top
C16  186.29,32.15 0 top
C17  181.37,32.95 0 top
C18  181.13,52.63 0 top
C19  190.66,39.93 0 top
C20  181.45,36.91 90 top
C21  167.32,31.36 90 top
C22  165.42,32.15 180 top
C23  192.88,48.34 0 top
C24  184.94,47.71 0 top
C25  181.93,43.42 90 top
C26  178.12,41.99 90 top
C27  120.49,69.14 90 top
C28  178.91,46.44 0 top
C32  177.72,15.13 180 top
C33  191.61,25.6 90 top
C34  173.2,23.74 270 top
D1  195.1,59.3 180 top
D2  163.51,57.71 180 top
D3  114.78,71.52 270 top
D4  166.37,75.49 0 top
D5  189.23,64.54 270 top
D6  169.23,52.47 0 top
D7  172.09,74.22 135 top
D8  116.68,52.47 90 top
F2  86.52,65.93 90 top
F4  125.86,18.31 90 top
FAN  97.79,78.67 0 top
H1  105,110 0 top
H2  136,20.25 0 top
H5  5.58,110 0 top
H6  5.33,20.25 0 top
H8  209.43,109.75 0 top
H9  209.32,20.35 0 top
HS1  172.18,90.09 180 top
HS2  107.95,68.82 270 top
HS3  121.13,52.47 270 top
IC1  107.95,68.82 90 top
IC2  157.8,58.19 270 top
IC3  167.96,44.53 270 top
IC4  121.13,52.47 90 top
IC7  185.42,36.12 270 top
IC8  171.13,33.1 0 top
IC9  186.85,51.68 90 top
ISP  165.1,20.4 180 top
J1  10,75.17 270 top
J2  10,46.12 90 top
L1  190.66,37.87 0 top
L2  165.42,27.23 90 top
OUT  203.52,76.12 90 top
PANEL  196.37,19.93 90 top
Q1  183.59,14.41 180 top
R1  168.59,28.34 0 top
R2  114.78,65.33 270 top
R3  109.38,62.31 180 top
R4  168.12,59.77 180 top
R5  165.89,57.55 270 top
R6  165.89,50.41 180 top
R7  193.99,45.49 180 top
R8  159.86,52.31 270 top
R9  159.86,48.34 270 top
R10  162.72,52.31 270 top
R11  175.1,46.44 180 top
R12  162.2,26.08 180 top
R13  99.06,66.92 270 top
R14  191.77,53.42 270 top
R15  192.88,50.57 0 top
R16  184.94,45.65 180 top
R17  184.94,43.58 180 top
R18  175.1,44.38 0 top
R19  175.1,42.31 0 top
R20  174.31,50.57 0 top
R21  178.91,48.5 0 top
R22  189.55,47.23 270 top
R23  157.8,63.82 0 top
R26  174.78,78.03 0 top
R28  186.85,55.49 180 top
R29  185.9,57.55 180 top
R30  181.13,55.01 0 top
R31  182.4,57.23 0 top
REL1  195.1,68.82 90 top
RESET  165.1,10.32 0 top
SERIAL  186.21,3.42 180 top
SUPPLY  129.06,75.81 90 top
T1  169.7,70.57 0 top
T2  188.59,43.26 180 top
T3  173.99,38.98 180 top
T4  170.02,89.94 0 top
T5  179.86,59.3 315 top
T6  197.49,46.6 0 top
TFUSE  140.34,62.87 90 top
TR1  99.56,24.5 0 top
TR2  48.9,45.8 0 top
U1  181.93,24.25 90 top
U$10  [CASE-Z17]  107.47,40.09 0 top
U$18  [IEC-C14-FUSED-6200.2200]  33.66,143.44 0 top  (outside the outline)
U$21  [FAN60X25]  173.67,127.56 0 top  (outside the outline)

### Tracks (layer width: path | path; a pad name or v marks a point on that pad's centre or on a via)
5V_A  (via drill 0.35)
  Top 0.203: 184.94,42.47 184.94,48.98 185.26,49.3 185.26,50.41 187.37,52.52 187.37,54.69 R28.1
  Top 0.406: U1.27 182.73,31.2 183.04,31.52 184.86,31.52 185.3,31.95 C16.1 185.42,32.07 | T3.C 174.47,37.71 v176.37,39.61 | v181.93,39.61 186.21,39.61 187.91,37.91 189.71,37.91 | 184.94,42.47 185.42,41.99 T2.C
  Top 0.61: 185.58,32.23 C16.1
  Top 0.813: 185.3,31.95 185.42,32.07 IC7.3 187.96,34.22 189.66,35.91 L1.1 189.71,37.91 C19.1 188.59,41.04 T2.C
  Bottom 0.406: v176.37,39.61 v181.93,39.61
5V_A2  (via drill 0.35)
  Top 0.203: IC8.1 169.18,31 171.29,33.1 v171.45,33.1 | IC8.9 172.43,35.04 v172.4,35.01
  Top 0.305: IC8.1 167.54,30.19 C21.1
  Bottom 0.203: v172.4,35.01 172.4,34.06 v171.45,33.1
  pour Top (isolate 0.305, no thermals): 168.28,27.55 164.47,27.55 164.47,31.36 166.21,31.36 166.21,31.04 168.28,31.04
34V_FUSED
  Top 0.305: IC2.1 156.45,60.09 157.16,60.8 157.16,63.82 R23.1 154.78,63.82
  Top 0.406: IC2.2 152.56,58.82 C4.2 152.4,63.66 152.56,63.82
  Top 2.54: TFUSE.1 145.57,60.33 149.07,63.82 152.56,63.82 154.78,63.82
+5V  (via drill 0.35)
  Top 0.203: R12.1 165.27,26.08 L2.1
  Top 0.406: U1.38
  Top 0.508: 191.53,24.25 U1.17 185.22,24.25 184.42,25.05 180.82,25.05 | 191.53,24.25 C33.1 | 191.53,24.25 192.65,24.25 194.43,22.47 196.37,22.47 PANEL.13 | C34.1 173.56,25.05 U1.38 180.82,25.05 | C32.1 178.87,15.12 181.13,17.38 U1.5 181.13,19.77 v180.82,20.09 | v180.82,24.37 180.82,25.05
  Top 0.61: REL1.+ 197.64,59.79 D1.C 199.71,56.74 v199.71,40.32 199.71,24.29 199.16,23.74 PANEL.13 | v170.18,20.09 170.18,24.53 | L1.2 196.78,37.87 197.56,38.65 5V.2
  Top 0.813: L2.1 165.42,25.28 166.16,24.53 170.18,24.53 173.04,24.53 C34.1
  Bottom 0.508: v180.82,20.09 v180.82,24.37
  Bottom 0.61: v170.18,20.09 169.23,19.13 ISP.2 | 5V.2 v199.71,40.32
+5V_PSU
  Top 1.27: D8.A 123.66,55.02 IC4.3 126.21,55.01 C7.1 126.52,69.46 SUPPLY.1
+9,5V
  Top 1.27: 116.69,49.93 C6.1 IC4.1 125.89,47.71 BR2.DC+ | 116.69,49.93 D8.C | 116.69,49.93 108.15,49.93 C3.+ 105,51.08 99.06,57.03 R13.2
+27V  (via drill 0.35)
  Top 0.406: C24.1 IC9.8 183.36,49.77 183.04,50.09 180.02,50.09 175.58,54.53 27V.2 174.15,54.53 171.61,51.99 171.61,50.25 170.81,49.45 v170.34,49.45 | IC3.4 v163.83,44.53 C8.1
  Bottom 0.406: v170.34,49.45 165.42,44.53 v163.83,44.53
+27V_PSU
  Top 1.27: R2.1 D3.A | D3.A 110.64,68.97 IC1.2 | D3.A 116.84,68.98 117.95,67.87 C27.+ 122.24,67.87 123.83,69.46 123.83,76.6 126.84,79.62 SUPPLY.4
+34V
  Top 1.27: IC1.3 110.49,74.06 | 110.49,74.06 C2.2 | 110.49,74.06 114.77,74.06 D3.C 114.78,83.9 C1.+
  Top 2.54: BR1.+ 105.09,94.54 C1.+ 136.28,84.38 140.34,80.33 TFUSE.2
+V_ADJ  (via drill 0.35)
  Top 0.203: v165.1,54.69 160.18,54.69 159.86,54.38 R8.1 | v169.54,55.65 170.97,55.65 178.12,62.79 181.58,62.79 C10.+ 185.45,61.49 191.77,55.17 R14.1
  Top 0.813: REL1.P1 REL1.O1 192.1,67.09 D5.C | C10.+ 181.26,61.49
  Bottom 0.203: v165.1,54.69 166.05,55.65 v169.54,55.65
  pour Top (isolate 0.61, no thermals): 177.48,79.78 179.86,79.78 179.86,70.25 180.34,69.78 190.34,69.78 191.45,70.89 194.63,70.89 194.63,64.54 187.17,64.54 187.17,59.62 186.85,59.3 180.66,59.3 175.42,64.54 175.42,77.71
ADC_CH0
  Top 0.203: U1.33 177.93,30.44 176.85,31.52 176.85,38.66 178.04,39.85 178.04,40.96 | 178.04,40.96 C26.1 | R19.2 176.1,41.31 176.45,40.96 178.04,40.96
  Top 0.406: 177.96,30.09 U1.33
ADC_CH1
  Top 0.203: U1.32 178.73,30.91 177.8,31.83 177.8,38.34 179.55,40.09 179.55,43.9 177.96,45.49 C28.1 177.91,46.49 R21.1 177.91,48.71 177.48,49.14 177.48,49.45 176.37,50.57 R20.2
  Top 0.406: 178.75,30.08 U1.32
ADC_CH2
  Top 0.203: U1.31 179.53,31.38 178.75,32.15 178.75,38.02 181.61,40.72 181.93,41.04 C25.1 182.83,42.47 R17.2
AGND  (via drill 0.35)
  Top 0.305: v173.83,35.96 173.73,36.02 IC8.8 | IC8.12 170.48,37.06 v170.5,37.07
  Top 0.406: IC3.11 v171.93,44.53 | C4.1 152.8,56.36 154.87,56.36 IC2.4
  Top 0.61: IC9.4 v188.44,53.58 | v156.53,56.28 IC2.4
  Top 0.813: v191.61,41.2 C19.2 | v186.21,49.45 186.21,48.34 C24.2 | v182.25,34.53 182.25,33.02 C17.2 | C21.2 v167.32,33.74 C22.2 | C28.2 179.86,47.39 | 179.86,47.39 179.86,48.45 R21.2 179.86,48.55 | v188.75,32.15 C16.2 | R16.2 v182.09,45.65 181.93,45.49 C25.2 | R15.2 193.83,50.52 v193.83,49.45 C23.2 | R7.2 193.04,45.44 v193.04,44.22 | v170.34,59.77 R4.1 | C26.2 178.12,43.42 v177.32,44.22 177.16,44.38 R18.2 | 179.86,47.39 v181.13,47.39 | R29.2 184.47,57.23 | 184.47,57.23 R31.2 | 184.47,57.23 184.15,57.15 v184.15,55.88 | C8.2 v160.66,45.8 159.86,46.6 R9.2
  pour Bottom (isolate 0.254, no thermals): 164.03,31.4 188.48,31.4 193.99,36.91 193.99,41.99 194.94,41.99 194.94,54.22 190.66,58.5 180.34,58.5 178.28,60.57 151.33,60.57 151.33,50.53 163.99,37.87
BTN1
  Top 0.203: U1.22 189.46,28.25 189.87,28.66 192.88,28.66 193.99,27.55 196.37,27.55 PANEL.17
BTN2
  Top 0.203: U1.24 185.13,29.11 185.42,28.82 186.21,28.82 187.01,29.61 193.04,29.61 193.52,30.09 196.37,30.09 PANEL.19
BTN3
  Top 0.203: U1.25 184.33,28.96 184.94,28.34 186.37,28.34 187.17,29.14 193.04,29.14 193.36,28.82 PANEL.18
BTN4  (via drill 0.35)
  Top 0.203: U1.26 183.53,28.8 184.94,27.39 v185.9,27.39 | v190.66,30.56 191.45,31.36 PANEL.20
  Bottom 0.203: v190.66,30.56 187.48,27.39 v185.9,27.39
DAC_CS
  Top 0.203: R1.2 169.59,28.14 171.87,25.85 U1.37
  Top 0.305: IC8.3 170.48,29.23 R1.2
GND_OUT_CONN
  pour Top (isolate 0.254, no thermals): 205.1,71.68 205.1,75.17 196.69,75.17 196.69,71.68
ISET
  Top 0.305: IC8.14 169.18,37.75 168.59,38.34 163.99,38.34 163.04,39.3 163.04,42.79 163.51,43.26 IC3.5
L
  Top 2.54: J2.A2 J2.A1 25.32,28.3 TR2.2 41.36,18.34 80.01,18.34 86.36,11.99 TR1.2
  pour Bottom (no thermals): 6.67,52.95 13.34,52.95 13.18,39.3 6.67,39.3
  pour Top (no thermals): 6.67,52.95 13.34,52.95 13.18,39.3 6.67,39.3
LCD_DB0
  Top 0.127: PANEL.1 196.37,9.77 194.47,9.77 190.18,14.05 190.18,15.48 186.69,18.98 186.69,19.29 184.13,21.85 U1.42
LCD_DB1  (via drill 0.35)
  Top 0.203: U1.43 183.66,21.05 v184.47,20.25 | v186.85,17.86 189.71,15.01 189.71,13.89 PANEL.2
  Bottom 0.203: v184.47,20.25 v186.85,17.86
LCD_DB2  (via drill 0.35)
  Top 0.203: PANEL.3 196.37,12.31 194.47,12.31 188.75,18.02 v188.75,19.29 | U1.40 184.28,23.45 v186.21,21.52
  Bottom 0.203: v186.21,21.52 188.44,19.29 v188.75,19.29
LCD_DB3
  Top 0.127: U1.41 183.81,22.65 187.01,19.45 187.01,19.13 PANEL.4
LCD_DB4
  Top 0.203: U1.16 190.94,23.45 194.47,19.93 196.37,19.93 PANEL.11
LCD_DB5  (via drill 0.35)
  Top 0.203: v189.87,25.32 189.34,25.85 U1.19
  Bottom 0.203: v189.87,25.32 190.5,25.32 194.63,21.2 PANEL.12
LCD_DB6
  Top 0.203: U1.20 189.13,26.65 190.18,27.71 192.56,27.71 192.88,27.39 192.88,25.8 193.68,25.01 196.37,25.01 PANEL.15
LCD_DB7
  Top 0.203: U1.21 189.29,27.45 190.02,28.18 192.72,28.18 193.36,27.55 193.36,26.59 193.68,26.28 PANEL.16
LCD_E
  Top 0.203: U1.14 190,21.85 194.47,17.39 196.37,17.39 PANEL.9
LCD_RS
  Top 0.203: U1.15 190.47,22.65 194.47,18.66 PANEL.10
LED
  Top 0.203: U1.12 189.06,20.25 194.47,14.85 196.37,14.85 PANEL.7
LED_PWM
  Top 0.203: U1.13 189.53,21.05 194.47,16.12 PANEL.8
MISO
  Top 0.203: ISP.1 169.07,20.25 169.07,17.55 169.7,16.91 171.13,16.91 171.45,17.23 178.44,17.23 178.73,17.52 U1.2
MOSI  (via drill 0.35)
  Top 0.203: IC8.5 171.78,28.96 172.4,28.34 v172.4,26.91 | v167.8,17.23 167,17.23 ISP.4 | U1.1 171.61,18.45 | 171.61,18.45 170.77,18.45 v170.18,17.86 | v171.61,23.42 171.61,18.45
  Bottom 0.203: v170.18,17.86 169.54,17.23 v167.8,17.23 | v172.4,26.91 171.61,26.12 v171.61,23.42
N
  Bottom 2.54: J1.A1 J1.A2 22.03,72.67 TR2.1 45.72,48.98 45.72,23.42 50.8,18.34 71.12,18.34 87.06,34.28 TR1.1
  pour Bottom (no thermals): 6.67,82 13.34,82 13.18,68.35 6.67,68.35
  pour Top (no thermals): 6.67,82 13.34,82 13.18,68.35 6.67,68.35
N$1
  Top 0.305: IC2.8 159.14,60.09 158.43,60.8 158.43,63.82 R23.2
  Top 0.813: 164.15,75.65 D4.C | T1.2 169.7,67.55 165.97,63.82 R23.2
  pour Top (isolate 0.254, no thermals): 164.94,62.16 159.09,62.16 159.09,91.36 171.13,91.36 171.13,83.59 164.94,77.39
N$4
  Top 1.27: R2.2 112.76,62.31 R3.1 110.38,66.17 IC1.1
N$5
  Top 0.203: IC2.5 161.45,56.28 162.88,57.71 163.51,57.71 164.47,58.66 D2.1 165.47,58.98 R5.1 166.1,58.55 167.12,59.57 R4.2
N$6
  Top 0.203: IC3.6 167.64,41.99 | 167.64,41.99 169.07,41.99 170.34,43.26 IC3.10 172.24,43.26 172.72,43.74 172.72,45.96 173.2,46.44 R11.2 | R5.2 165.89,49.14 167.64,47.39 167.64,41.99 | R5.2 165.78,56.6 | D2.3 163.67,56.6 165.78,56.6 | R5.2 165.89,56.6 | 165.89,56.6 165.89,56.71 | 165.78,56.6 165.89,56.6
N$7
  Top 0.406: IC3.1 | IC3.1 164.78,48.34 164.78,50.3 R6.2 | IC3.1 164.9,48.5 | IC3.1 164.58,48.82 163.19,48.82 C12.2
N$8
  Top 0.406: 167,50.45 R6.1 166.89,50.88 | 166.89,50.88 166.89,52.74 | 166.89,52.74 C11.2 | 166.89,52.74 166.89,54.9 172.24,60.25 T1.3 | D6.1 167.96,50.88 166.89,50.88
  Top 0.813: D7.C 172.24,72.33 T1.3
N$9
  Top 0.203: C11.1 164.74,53.31 R10.1
N$10  (via drill 0.35)
  Top 0.203: 169.7,45.96 169.39,46.28 169.39,48.82 169.23,48.98 D6.3 | 169.7,45.96 169.86,45.8 IC3.12 | 169.7,45.96 169.07,45.33 v169.07,43.26 | C13.2 173.2,48.5 172.56,47.87 172.56,47.07 171.29,45.8 | v169.07,41.04 168.75,40.72 IC3.7
  Top 0.305: 171.29,45.8 IC3.12
  Bottom 0.203: v169.07,43.26 v169.07,41.04
N$11
  Top 0.203: R20.1 173.31,50.36 171.29,48.34 IC3.14 IC3.13
N$12
  Top 0.203: 176.05,47.12 C13.1
  Top 0.305: R11.1 176.05,47.12
N$13
  Top 0.61: 192.56,59.79 REL1.- | T6.3 197.49,54.87 D1.A
  Top 0.813: D1.A 192.56,59.79
N$14
  Top 0.406: U1.7 182.73,15.54 Q1.2
  Top 0.813: Q1.2 180.22,13.04 C14.2
N$15
  Top 0.406: Q1.1 185.54,14.41 183.53,16.42 U1.8
  Top 0.813: Q1.1 186.97,13.04 C15.2
N$16
  Top 0.203: IC9.1 189.55,49.61 R22.1
N$17
  Top 0.203: IC9.3 191.66,52.31 | 191.88,48.39 R15.1 191.88,52.31
  Top 0.406: 191.66,52.31 R14.2
  Top 0.813: C23.1 191.88,48.39 | 191.88,52.31 R14.2
N$18
  Top 0.203: IC3.2 163.04,47.07 162.8,47.31 162.56,47.07 | C12.1 161.61,47.39 161.29,47.71 161.29,49.14 161.08,49.34 R9.1 R8.2 R10.2 162.67,51.31
  Top 0.406: 162.8,47.31 C12.1
N$19
  Top 0.203: IC9.2 188.59,51.04 187.64,50.09 T2.E 187.32,44.22 186.37,44.22 185.94,43.79 | 185.94,43.79 R17.1 | R16.1 185.94,43.79
N$20
  Top 0.203: 173.62,41.99 173.35,41.99 | 173.35,41.99 IC3.9 | T3.E 173.35,40.56 173.35,41.99
  Top 0.406: R19.1 173.62,41.99
  Top 0.813: R19.1 R18.1
N$21
  Top 0.203: R22.2 T2.B
N$22
  Top 0.203: 184.31,53.58 IC9.5 | R28.2 185.85,55.28 | 184.26,53.58 IC9.5 | R28.2 186.37,55.69 186.37,56.71 R29.1 | R28.2 185.85,54.49 184.94,53.58 IC9.5
N$23
  pour Top (isolate 0.254, no thermals): 167.96,74.38 167.96,78.51 172.56,83.11 172.56,91.36 179.86,91.36 179.86,81.05 176.53,81.05 174.15,78.67 174.15,75.49 172.09,75.49 170.97,74.38
N$24
  Top 0.203: T3.B 174.94,39.45 174.62,39.14 171.93,39.14 170.86,40.2 IC3.8
N$25
  Top 0.203: IC9.6 182.25,52.31 | R30.2 182.09,54.96 C18.2
  Top 0.406: 182.25,52.31 C18.2
N$26
  Top 0.203: T5.1 178.12,58.9 178.12,54.69 C18.1 180.18,51.52 180.66,51.04 IC9.7
N$27
  Top 2.54: F4.3 F4.4 125.89,28.5 BR2.AC1
N$28
  Bottom 0.813: T1.1 164.56,73.17 T4.B
N$29
  Top 2.54: TR2.3 66.39,43.22 77.68,54.5 F2.1 F2.2
N$30
  Top 0.203: 180.13,57.23 R30.1
  Top 0.813: R31.1 180.13,57.23 T5.2
N$31
  Top 2.54: F2.3 F2.4 88.27,77.84 BR1.AC1
N$32
  Top 2.54: TR2.4 66.39,64.42 83.19,81.2 BR1.AC2
N$33
  Top 2.54: TR1.3 115.32,11.99 | TR1.5 115.08,32 116.23,30.84 116.23,12.91 115.32,11.99 | 115.32,11.99 115.36,11.96 F4.2 F4.1
N$34
  Top 2.54: TR1.4 108.97,17 107.5,18.46 107.5,35.77 108.73,36.99 TR1.6 119.3,36.99 BR2.AC2
N$35
  Top 1.27: R13.1 FAN.2
P_VSS  (via drill 0.35)
  Top 0.813: C9.2 v181.45,72.39 | D5.A | C5.2 v168.84,92.71 | C2.1 v107.31,75.01 | R3.2 v107.16,62.31
  Top 1.27: C6.2 120.97,52.47 IC4.2 126.21,52.47 C7.2
  other vias: 189.87,60.73 188.59,60.73 189.87,63.27 188.59,63.27
  pour Bottom (isolate 0.61, no thermals): 151.33,61.36 178.75,61.36 180.66,59.3 190.5,59.3 190.5,64.22 201.29,64.22 201.29,98.98 151.33,98.98
  pour Top (isolate 0.254, no thermals): 190.5,60.25 187.96,60.25 187.96,63.74 190.5,63.74
  pour Bottom: 124.62,98.98 151.92,98.98 151.92,81.68 124.62,81.68
  pour Bottom (isolate 0.61, no thermals): 131.92,40.32 118.27,40.32 118.27,48.1 105.25,48.1 92.55,60.8 92.55,90.17 75.41,90.17 75.41,99.06 95.73,98.98 131.92,98.98
REL-OUT
  Top 0.203: 185.93,30.12 186.21,30.41 188.91,30.41 192.48,33.97 196.37,33.97 198.91,36.51 198.91,41.59 196.53,43.97 T6.1
  Top 0.406: 185.93,30.12 U1.23
  Top 0.813: T6.1 195.15,45.33 R7.1
RESET
  Top 0.203: ISP.5 161.29,20.4 161.29,16.12 161.77,15.64 161.93,15.64 | U1.4 180.33,17.53 179.07,16.28 173.83,16.28 | 173.83,16.28 172.09,16.28 171.45,15.64 161.93,15.64 | R12.2 161.2,23.03 ISP.5 | ISP.5 | RESET.1 161.93,15.64 | 173.83,16.28 173.83,10 180.41,3.42 SERIAL.4
RX
  Top 0.203: U1.9 184.33,17.37 185.1,16.59 186.53,16.59 188.75,14.37 188.75,10.24 187.48,8.97 SERIAL.2
SCK  (via drill 0.35)
  Top 0.203: 179.55,18.47 U1.3 179.53,17.53 178.75,16.75 171.77,16.75 171.29,16.28 164.15,16.28 163.83,16.59 163.83,20.4 ISP.3 | IC8.4 v171.13,27.86
  Bottom 0.203: v171.13,27.86 165.1,21.83 ISP.3
TX
  Top 0.203: U1.10 185.13,17.38 185.42,17.08 186.84,17.08 189.23,14.69 189.23,10.56 190.02,9.77 SERIAL.1
V_OUT_CONN
  pour Top (no thermals): 191.61,71.68 191.61,77.87 193.99,80.25 205.1,80.25 205.1,77.08 195.58,77.08 194.63,76.12 194.63,71.68
VREF4096  (via drill 0.35)
  Top 0.305: 169.83,35.04 IC8.13 | IC8.11 171.13,34.06
  Top 0.406: U1.29 181.13,31.05 180.42,31.75 C17.1 | 169.83,35.04 170.81,34.06 171.13,34.06 174.15,34.06 v175.1,35.01
  Top 0.813: IC7.2 185.38,36.16 C20.+ 180.7,36.16 180.42,35.88 C17.1
  Bottom 0.813: C20.+ 176.26,36.16 v175.1,35.01
VSET
  Top 0.203: IC3.3 166.05,45.8 166.37,45.49 166.37,42.95 166.05,42.63 163.83,42.63
  Top 0.305: IC8.10 171.78,37.53 170.34,38.98 164.31,38.98 163.67,39.61 163.67,42.47 163.83,42.63
VSS  (via drill 0.35)
  Top 0.406: U1.6 181.93,19.97 v182.05,20.09 | U1.18 186.17,25.05 v186.06,25.17 | U1.28 v181.93,28.34
  Top 0.508: U1.39 175.14,24.25 174.47,23.58 v174.47,22.79
  Top 0.61: v198.44,43.97 T6.2
  Top 0.813: C34.2 v174.47,22.79 | C15.1 184.94,11.51 v183.63,11.51 182.25,11.51 C14.1 | C33.2 191.65,26.59 v190.5,26.59 | C32.2 176.73,15.16 v175.54,15.16
  Bottom 0.61: v198.44,43.97 197.64,43.97 195.02,41.35 5V.1
  pour Bottom (isolate 0.254, no thermals): 194.79,36.6 198.91,36.6 198.91,1.51 176.53,1.51 176.53,6.43 159.74,6.43 159.74,30.56 188.75,30.56
  pour Bottom (isolate 0.254, no thermals): 196.22,42.79 196.22,36.6 192.72,36.6 192.72,42.79

### Text on the board
tNames: _ | + | + | +27V | VSS | +5V | _ | 1,6 A/T | _ | + | _ | + | RST | SCK | MISO | GND | MOSI | 5V | 630 mA/T | RST | GND | RX | TX | Netzteil_CA1 v1.2a / 2021, by azzurro@ne-mail.net